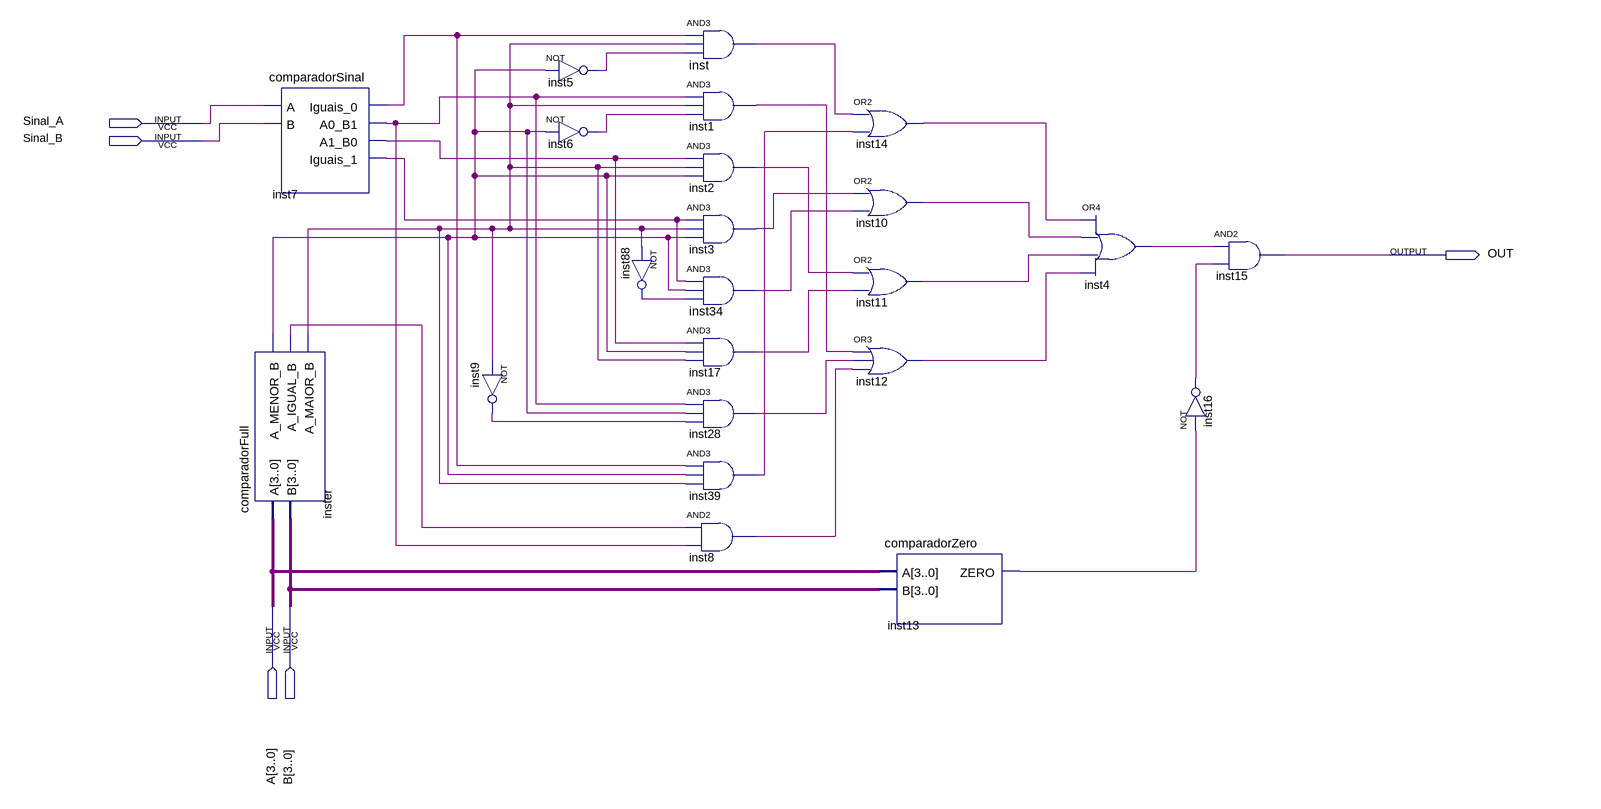
[diagram p0: schematic sheet]
// Quartus schematic comparadorMaior.bdf as structural Verilog: 23 symbols, 5 pins
module comparadorMaior (
  input  Sinal_A,
  input  Sinal_B,
  input  [3:0] A,
  input  [3:0] B,
  output OUT
);

  wire inst1_out, inst2_out, inst3_out, inst4_out, inst5_out, inst6_out, inst7_a0_b1, inst7_a1_b0,
       inst7_iguais_0, inst7_iguais_1, inst8_out, inst9_out, inst10_out, inst11_out, inst12_out, inst13_zero,
       inst14_out, inst16_out, inst17_out, inst28_out, inst34_out, inst39_out, inst88_out, inst_out,
       inster_a_igual_b, inster_a_maior_b, inster_a_menor_b;

  comparadorSinal inst7 (
    .A(Sinal_A), .B(Sinal_B), .Iguais_0(inst7_iguais_0), .A0_B1(inst7_a0_b1), .A1_B0(inst7_a1_b0),
    .Iguais_1(inst7_iguais_1));
  comparadorFull inster (
    .A(A), .B(B), .A_MENOR_B(inster_a_menor_b), .A_IGUAL_B(inster_a_igual_b), .A_MAIOR_B(inster_a_maior_b));
  not inst9 (inst9_out, inster_a_maior_b);
  not inst5 (inst5_out, inster_a_menor_b);
  not inst6 (inst6_out, inster_a_menor_b);
  not inst88 (inst88_out, inster_a_maior_b);
  and inst (inst_out, inst7_iguais_0, inster_a_maior_b, inst5_out);
  and inst1 (inst1_out, inst7_a0_b1, inster_a_maior_b, inst6_out);
  and inst2 (inst2_out, inst7_a1_b0, inster_a_maior_b, inster_a_menor_b);
  and inst3 (inst3_out, inst7_iguais_1, inster_a_maior_b, inster_a_menor_b);
  and inst34 (inst34_out, inst7_iguais_1, inster_a_menor_b, inst88_out);
  and inst17 (inst17_out, inst7_a1_b0, inster_a_menor_b, inster_a_maior_b);
  and inst28 (inst28_out, inst7_a0_b1, inster_a_menor_b, inst9_out);
  and inst39 (inst39_out, inst7_iguais_0, inster_a_menor_b, inster_a_maior_b);
  and inst8 (inst8_out, inster_a_igual_b, inst7_a0_b1);
  or inst14 (inst14_out, inst_out, inst39_out);
  or inst10 (inst10_out, inst3_out, inst34_out);
  or inst11 (inst11_out, inst2_out, inst17_out);
  or inst12 (inst12_out, inst1_out, inst28_out, inst8_out);
  comparadorZero inst13 (.A(A), .B(B), .ZERO(inst13_zero));
  or inst4 (inst4_out, inst14_out, inst10_out, inst11_out, inst12_out);
  and inst15 (OUT, inst4_out, inst16_out);
  not inst16 (inst16_out, inst13_zero);
endmodule
